# EAGLE schematic SeismicAccelerometerSystem (EAGLE 9.6.2)

## Sheet 1 of 3
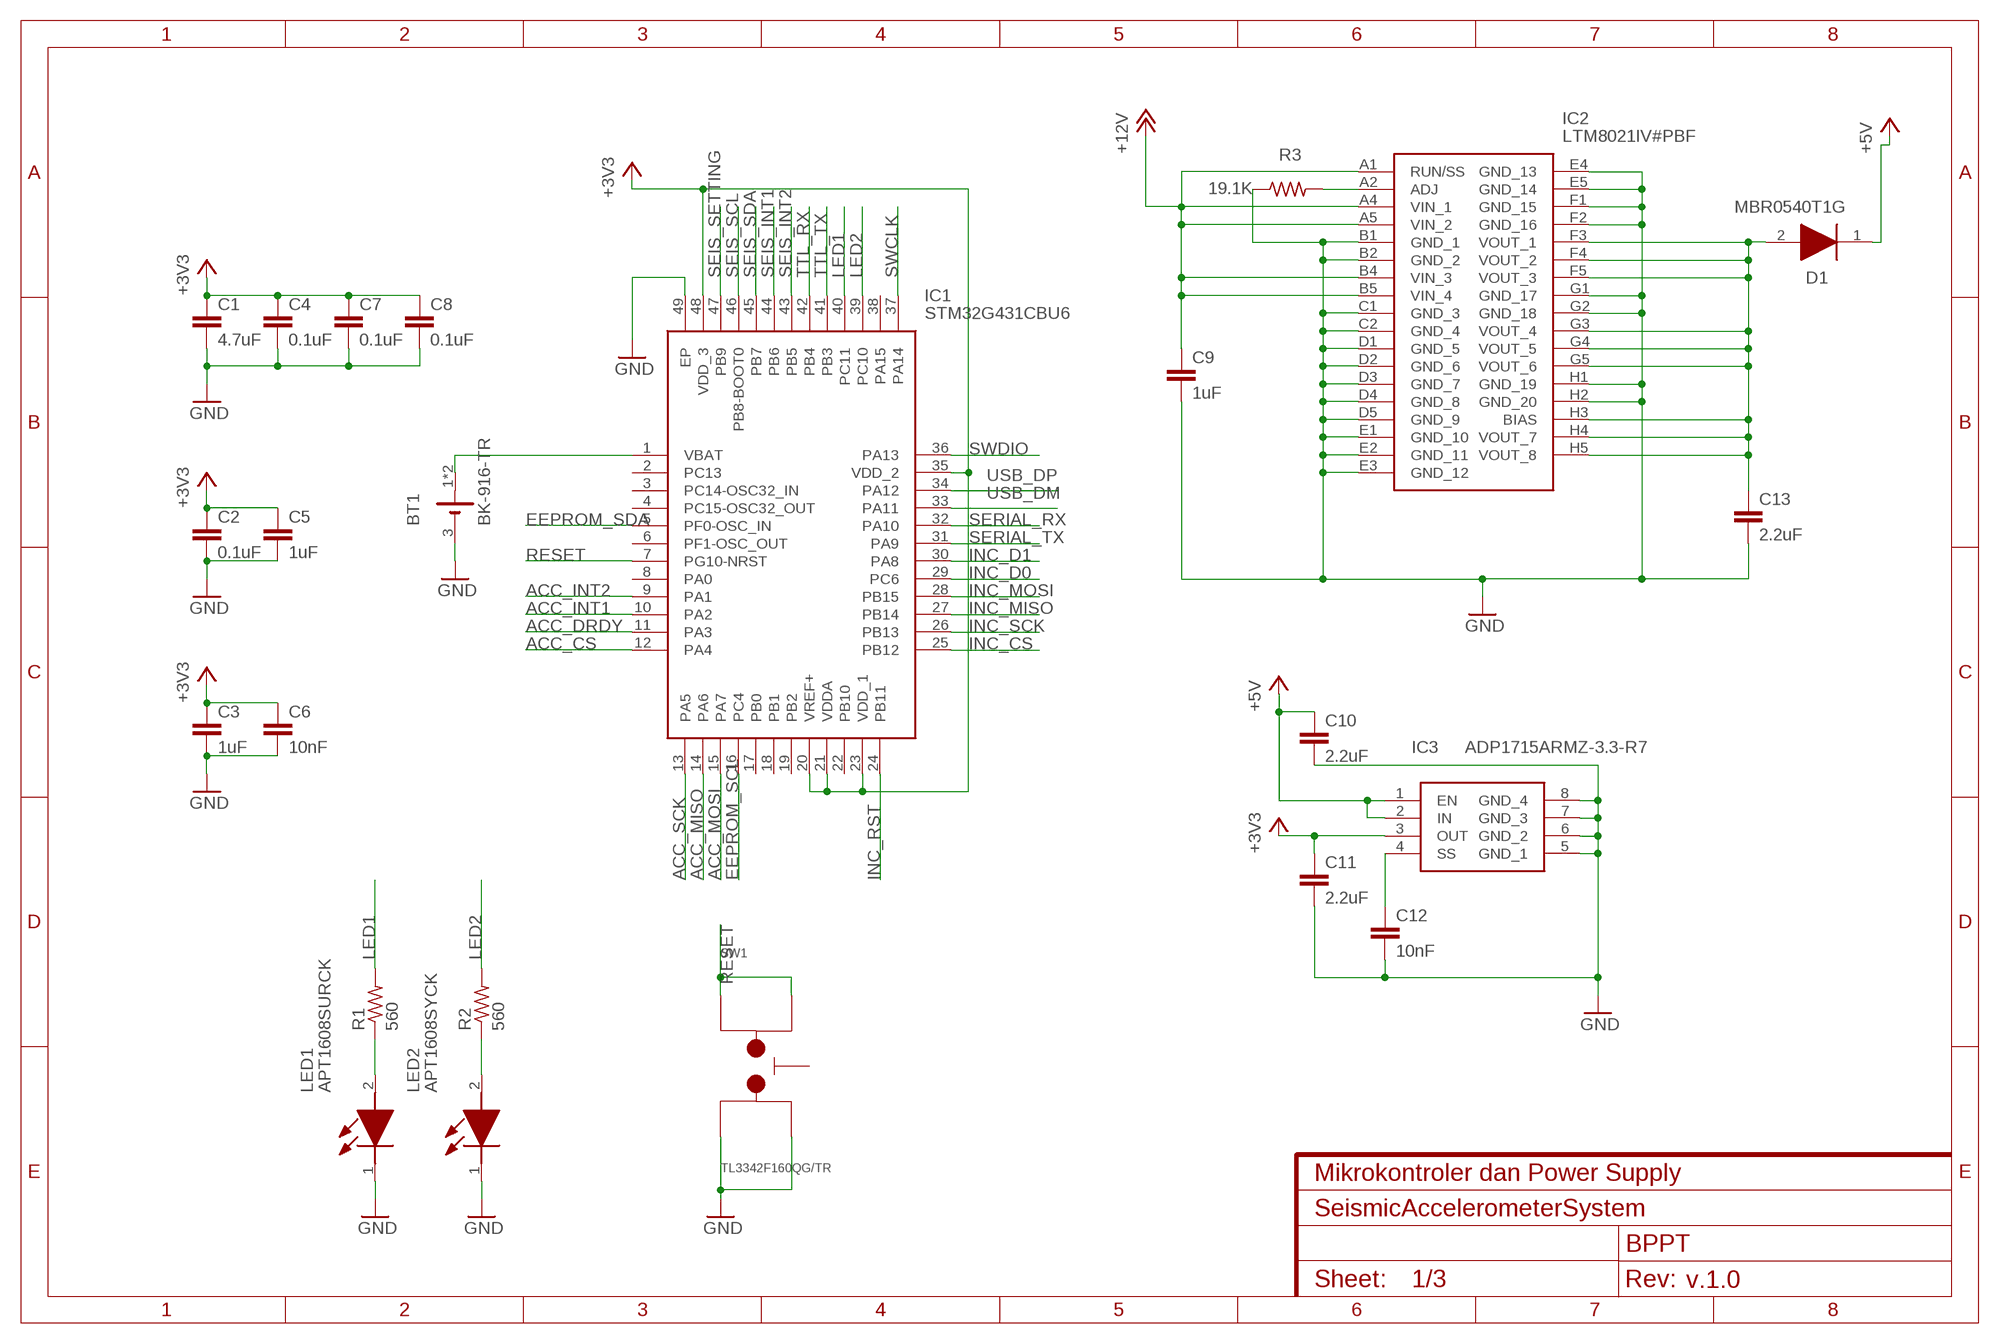
[diagram p0: schematic, sheet 1]
FRAME3 (FRAME-A4L): CNAME: Mikrokontroler dan Power Supply; CREVISION: v.1.0; DESIGNER: BPPT

### Parts
BT1  BK-916-TR  [BAT_BK-916-TR]
C1  4.7uF  C0603-KEMET  [CAPC1608X80N-0603-KEMET]
C2  0.1uF  C0402-KEMET  [CAPC1005X50N-0402-KEMET]
C3  1uF  C0402-KEMET  [CAPC1005X50N-0402-KEMET]
C4  0.1uF  C0402-KEMET  [CAPC1005X50N-0402-KEMET]
C5  1uF  C0402-KEMET  [CAPC1005X50N-0402-KEMET]
C6  10nF  C0402-KEMET  [CAPC1005X50N-0402-KEMET]
C7  0.1uF  C0402-KEMET  [CAPC1005X50N-0402-KEMET]
C8  0.1uF  C0402-KEMET  [CAPC1005X50N-0402-KEMET]
C9  1uF  C0805-KEMET  [CAPC2113X90N-0805-KEMET]
C10  2.2uF  C0603-KEMET  [CAPC1608X80N-0603-KEMET]
C11  2.2uF  C0603-KEMET  [CAPC1608X80N-0603-KEMET]
C12  10nF  C0402-KEMET  [CAPC1005X50N-0402-KEMET]
C13  2.2uF  C0805-KEMET  [CAPC2113X90N-0805-KEMET]
D1  MBR0540T1G  [SOD3716X135N]
IC1  STM32G431CBU6  [QFN50P700X700X65-49N]
IC2  LTM8021IV#PBF  [LTM8021IVPBF]
IC3  ADP1715ARMZ-3.3-R7  [SOP65P490X110-8N]
LED1  APT1608SURCK  [LEDC1608X85N]
LED2  APT1608SYCK  [LEDC1608X85N]
R1  560  R0402-TE  [RESC1005X30N]
R2  560  R0402-TE  [RESC1005X30N]
R3  19.1K  R0402-TE  [RESC1005X30N]
SW1  TL3342F160QG/TR  [TL3342F160QG/TR]

### Nets
+3V3: C1.1 C2.1 C3.1 C4.1 C5.1 C6.1 C7.1 C8.1 C11.1 IC1.20(VREF+) IC1.21(VDDA) IC1.23(VDD_1) IC1.35(VDD_2) IC1.48(VDD_3) IC3.3(OUT) ; also sheet 2,3
+5V: C10.1 D1.1(K) IC3.1(EN) IC3.2(IN) ; also sheet 3
+12V: C9.1 IC2.A1(RUN/SS) IC2.A4(VIN_1) IC2.A5(VIN_2) IC2.B4(VIN_3) IC2.B5(VIN_4) ; also sheet 3
ACC_CS: IC1.12(PA4) ; also sheet 2
ACC_DRDY: IC1.11(PA3) ; also sheet 2
ACC_INT1: IC1.10(PA2) ; also sheet 2
ACC_INT2: IC1.9(PA1) ; also sheet 2
ACC_MISO: IC1.14(PA6) ; also sheet 2
ACC_MOSI: IC1.15(PA7) ; also sheet 2
ACC_SCK: IC1.13(PA5) ; also sheet 2
EEPROM_SCL: IC1.16(PC4) ; also sheet 3
EEPROM_SDA: IC1.5(PF0-OSC_IN) ; also sheet 3
GND: BT1.3(-) C1.2 C2.2 C3.2 C4.2 C5.2 C6.2 C7.2 C8.2 C9.2 C10.2 C11.2 C12.2 C13.2 IC1.49(EP) IC2.B1(GND_1) IC2.B2(GND_2) IC2.C1(GND_3) IC2.C2(GND_4) IC2.D1(GND_5) IC2.D2(GND_6) IC2.D3(GND_7) IC2.D4(GND_8) IC2.D5(GND_9) IC2.E1(GND_10) IC2.E2(GND_11) IC2.E3(GND_12) IC2.E4(GND_13) IC2.E5(GND_14) IC2.F1(GND_15) IC2.F2(GND_16) IC2.G1(GND_17) IC2.G2(GND_18) IC2.H1(GND_19) IC2.H2(GND_20) IC3.5(GND_1) IC3.6(GND_2) IC3.7(GND_3) IC3.8(GND_4) LED1.1(K) LED2.1(K) R3.1 SW1.1 SW1.2 ; also sheet 2,3
INC_CS: IC1.25(PB12) ; also sheet 2
INC_D0: IC1.29(PC6) ; also sheet 2
INC_D1: IC1.30(PA8) ; also sheet 2
INC_MISO: IC1.27(PB14) ; also sheet 2
INC_MOSI: IC1.28(PB15) ; also sheet 2
INC_RST: IC1.24(PB11) ; also sheet 2
INC_SCK: IC1.26(PB13) ; also sheet 2
LED1: IC1.40(PC11) R1.2
LED2: IC1.39(PC10) R2.2
N$1: C13.1 D1.2(A) IC2.F3(VOUT_1) IC2.F4(VOUT_2) IC2.F5(VOUT_3) IC2.G3(VOUT_4) IC2.G4(VOUT_5) IC2.G5(VOUT_6) IC2.H3(BIAS) IC2.H4(VOUT_7) IC2.H5(VOUT_8)
N$2: BT1.1(+) BT1.2(+) IC1.1(VBAT)
N$50: IC2.A2(ADJ) R3.2
N$52: C12.1 IC3.4(SS)
N$104: LED1.2(A) R1.1
N$108: LED2.2(A) R2.1
RESET: IC1.7(PG10-NRST) SW1.3 SW1.4 ; also sheet 3
SEIS_INT1: IC1.44(PB6) ; also sheet 2
SEIS_INT2: IC1.43(PB5) ; also sheet 2
SEIS_SCL: IC1.46(PB8-BOOT0) ; also sheet 2
SEIS_SDA: IC1.45(PB7) ; also sheet 2
SEIS_SETTING: IC1.47(PB9) ; also sheet 2
SERIAL_RX: IC1.32(PA10) ; also sheet 3
SERIAL_TX: IC1.31(PA9) ; also sheet 3
SWCLK: IC1.37(PA14) ; also sheet 3
SWDIO: IC1.36(PA13) ; also sheet 3
TTL_RX: IC1.42(PB4) ; also sheet 3
TTL_TX: IC1.41(PB3) ; also sheet 3
USB_DM: IC1.33(PA11)
USB_DP: IC1.34(PA12)
Unconnected: IC1.2(PC13) IC1.3(PC14-OSC32_IN) IC1.4(PC15-OSC32_OUT) IC1.6(PF1-OSC_OUT) IC1.8(PA0) IC1.17(PB0) IC1.18(PB1) IC1.19(PB2) IC1.22(PB10) IC1.38(PA15)

## Sheet 2 of 3
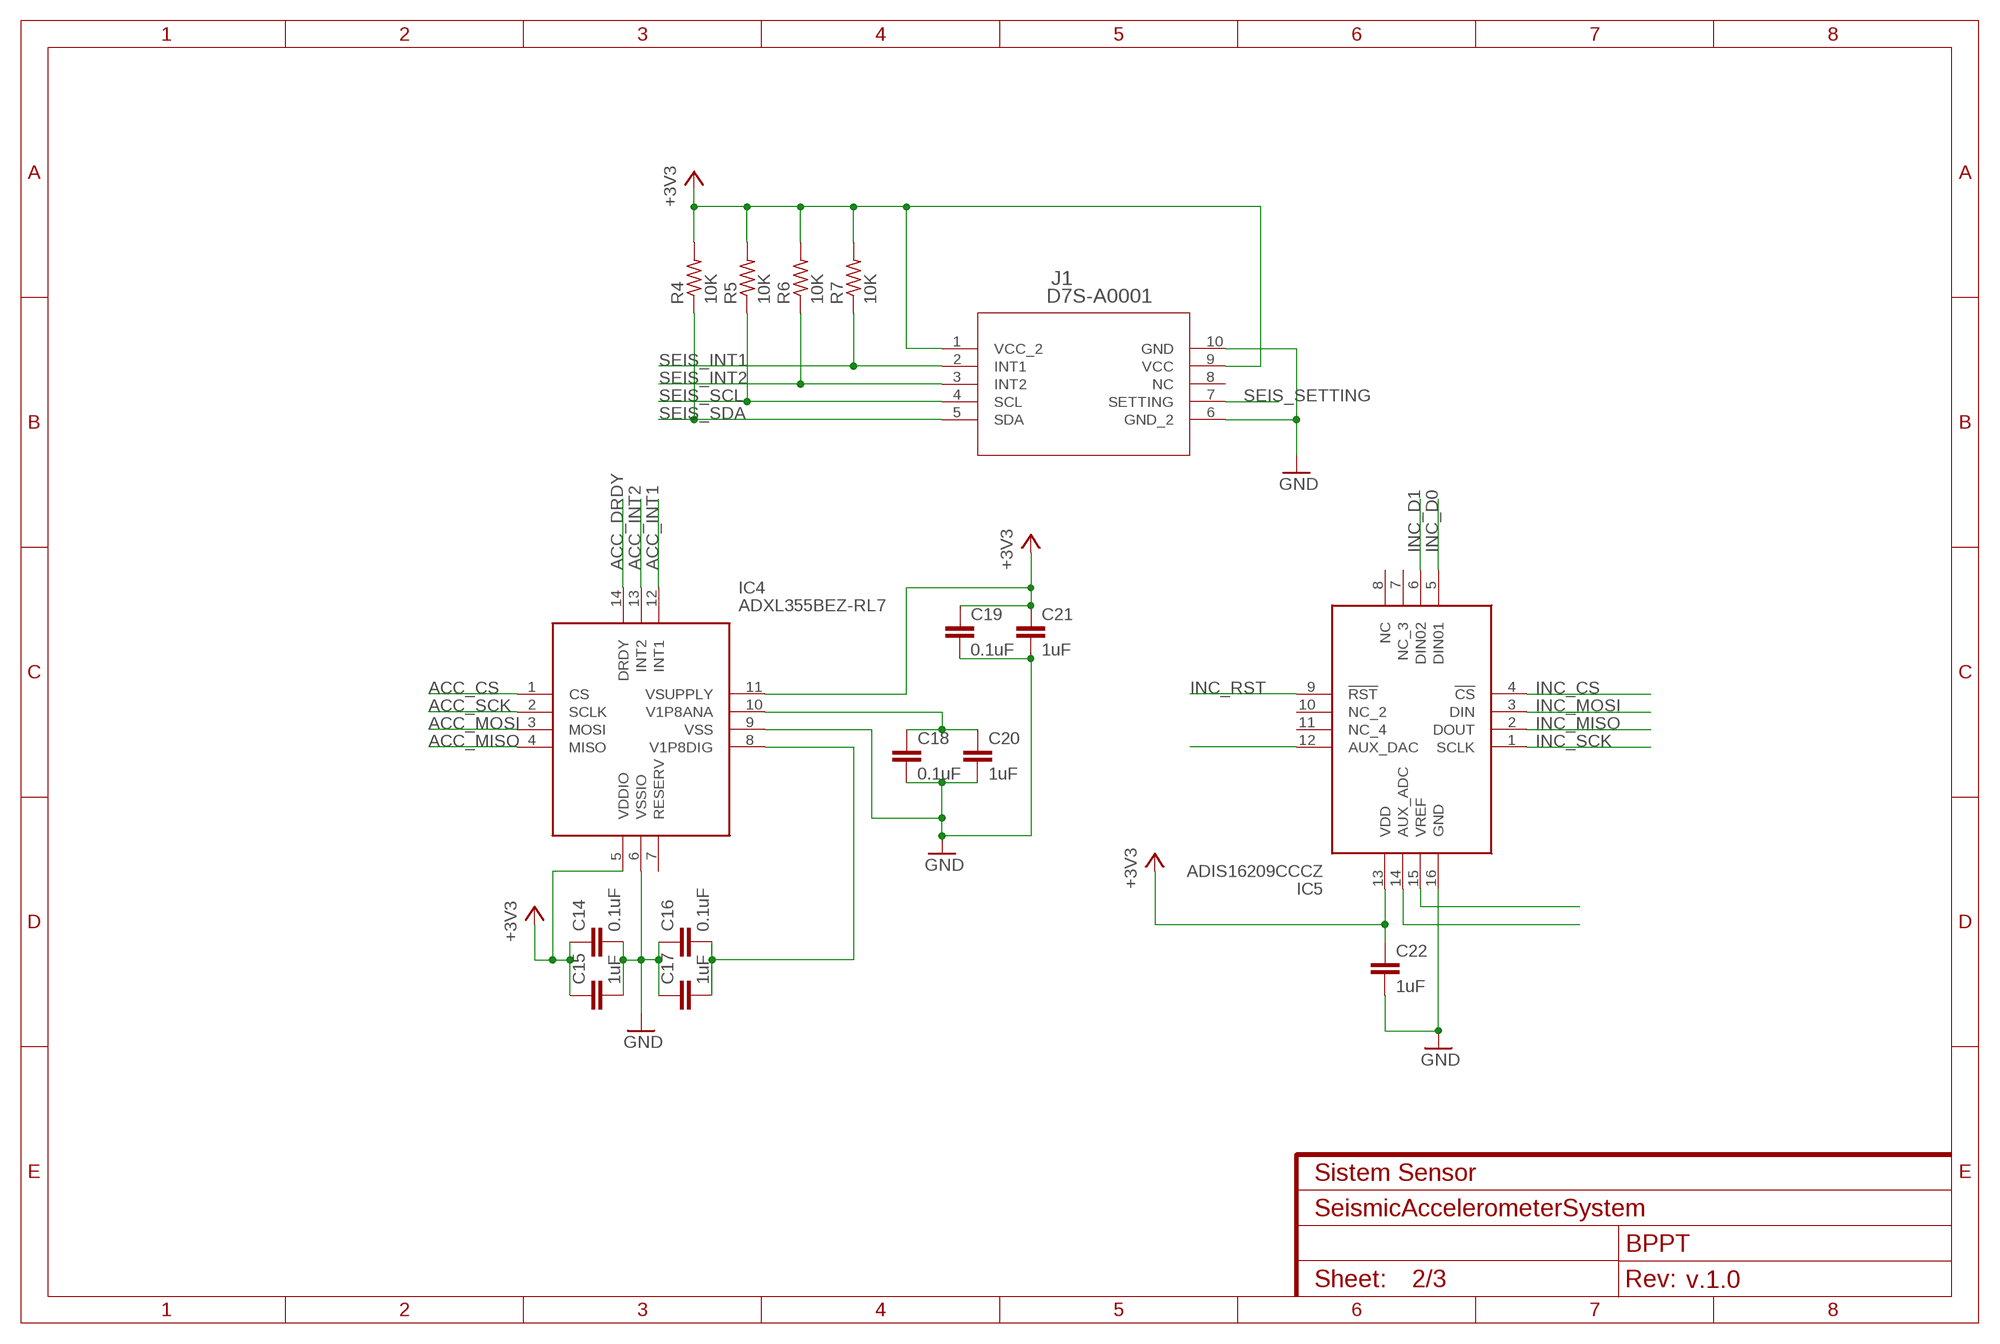
[diagram p1: schematic, sheet 2]
FRAME2 (FRAME-A4L): CNAME: Sistem Sensor; CREVISION: v.1.0; DESIGNER: BPPT

### Parts
C14  0.1uF  C0402-KEMET  [CAPC1005X50N-0402-KEMET]
C15  1uF  C0402-KEMET  [CAPC1005X50N-0402-KEMET]
C16  0.1uF  C0402-KEMET  [CAPC1005X50N-0402-KEMET]
C17  1uF  C0402-KEMET  [CAPC1005X50N-0402-KEMET]
C18  0.1uF  C0402-KEMET  [CAPC1005X50N-0402-KEMET]
C19  0.1uF  C0402-KEMET  [CAPC1005X50N-0402-KEMET]
C20  1uF  C0402-KEMET  [CAPC1005X50N-0402-KEMET]
C21  1uF  C0402-KEMET  [CAPC1005X50N-0402-KEMET]
C22  1uF  C0402-KEMET  [CAPC1005X50N-0402-KEMET]
IC4  ADXL355BEZ-RL7  [ADXL355BEZRL7]
IC5  ADIS16209CCCZ  [LGA16R180P4X4_933X933X390]
J1  D7S-A0001  [D7S-A0001_OMR]
R4  10K  R0402-TE  [RESC1005X30N]
R5  10K  R0402-TE  [RESC1005X30N]
R6  10K  R0402-TE  [RESC1005X30N]
R7  10K  R0402-TE  [RESC1005X30N]

### Nets
+3V3: C14.1 C15.1 C19.1 C21.1 C22.1 IC4.5(VDDIO) IC4.11(VSUPPLY) IC5.13(VDD) J1.1(VCC_2) J1.9(VCC) R4.2 R5.2 R6.2 R7.2 ; also sheet 1,3
ACC_CS: IC4.1(CS) ; also sheet 1
ACC_DRDY: IC4.14(DRDY) ; also sheet 1
ACC_INT1: IC4.12(INT1) ; also sheet 1
ACC_INT2: IC4.13(INT2) ; also sheet 1
ACC_MISO: IC4.4(MISO) ; also sheet 1
ACC_MOSI: IC4.3(MOSI) ; also sheet 1
ACC_SCK: IC4.2(SCLK) ; also sheet 1
GND: C14.2 C15.2 C16.1 C17.1 C18.2 C19.2 C20.2 C21.2 C22.2 IC4.6(VSSIO) IC4.9(VSS) IC5.16(GND) J1.6(GND_2) J1.10(GND) ; also sheet 1,3
INC_CS: IC5.4(!CS) ; also sheet 1
INC_D0: IC5.5(DIN01) ; also sheet 1
INC_D1: IC5.6(DIN02) ; also sheet 1
INC_MISO: IC5.2(DOUT) ; also sheet 1
INC_MOSI: IC5.3(DIN) ; also sheet 1
INC_RST: IC5.9(!RST) ; also sheet 1
INC_SCK: IC5.1(SCLK) ; also sheet 1
N$56: C16.2 C17.2 IC4.8(V1P8DIG)
N$57: C18.1 C20.1 IC4.10(V1P8ANA)
N$73: IC5.12(AUX_DAC)
N$77: IC5.15(VREF)
N$78: IC5.14(AUX_ADC)
SEIS_INT1: J1.2(INT1) R7.1 ; also sheet 1
SEIS_INT2: J1.3(INT2) R6.1 ; also sheet 1
SEIS_SCL: J1.4(SCL) R5.1 ; also sheet 1
SEIS_SDA: J1.5(SDA) R4.1 ; also sheet 1
SEIS_SETTING: J1.7(SETTING) ; also sheet 1
Unconnected: IC4.7(RESERV) IC5.7(NC_3) IC5.8(NC) IC5.10(NC_2) IC5.11(NC_4) J1.8(NC)

## Sheet 3 of 3
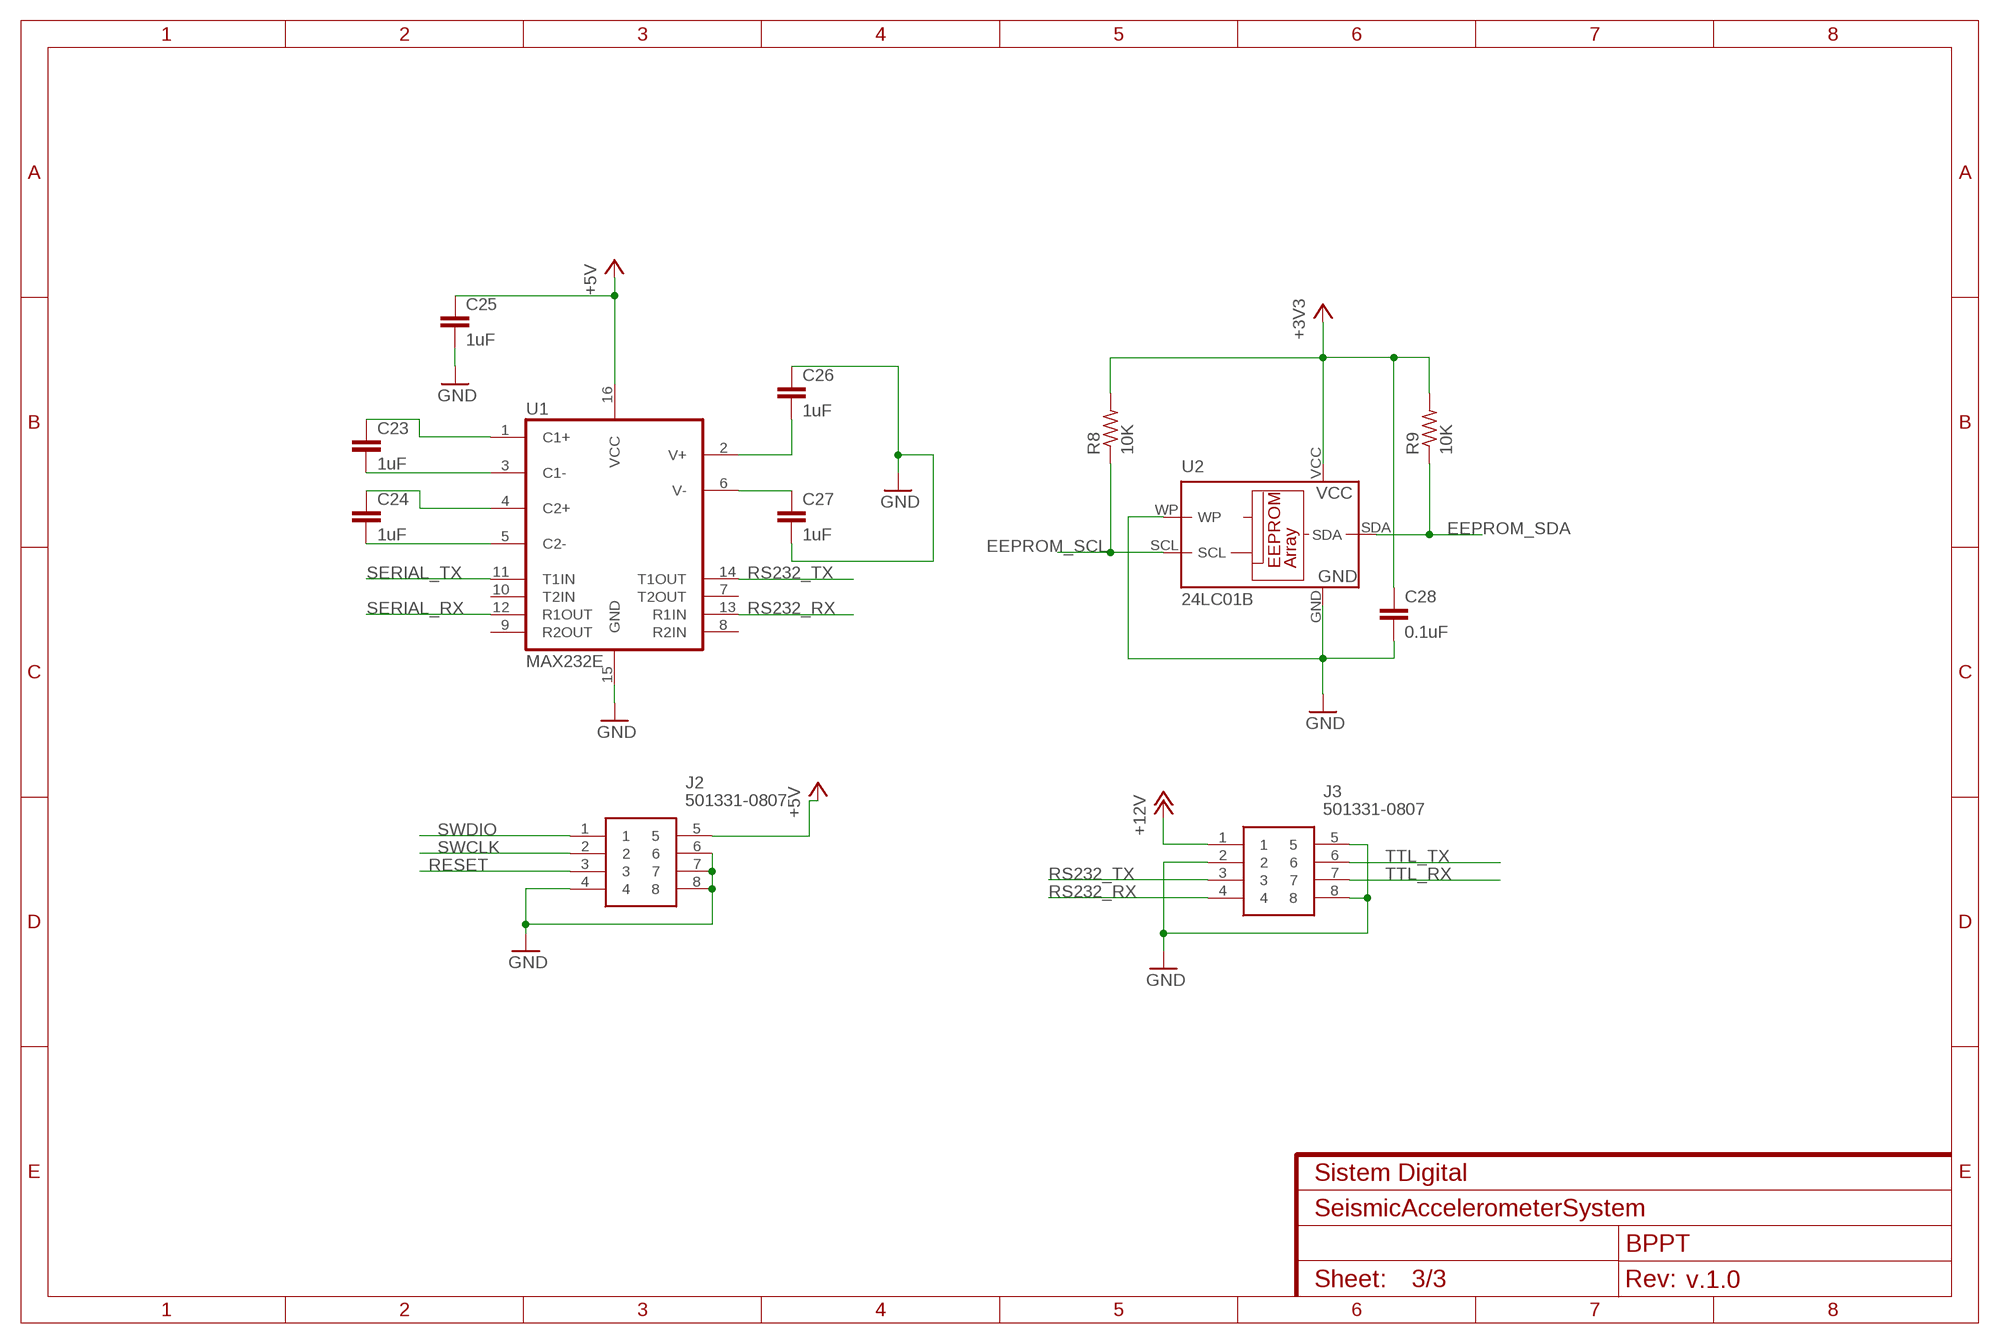
[diagram p2: schematic, sheet 3]
FRAME1 (FRAME-A4L): CNAME: Sistem Digital; CREVISION: v.1.0; DESIGNER: BPPT

### Parts
C23  1uF  C0603-KEMET  [CAPC1608X80N-0603-KEMET]
C24  1uF  C0603-KEMET  [CAPC1608X80N-0603-KEMET]
C25  1uF  C0603-KEMET  [CAPC1608X80N-0603-KEMET]
C26  1uF  C0603-KEMET  [CAPC1608X80N-0603-KEMET]
C27  1uF  C0603-KEMET  [CAPC1608X80N-0603-KEMET]
C28  0.1uF  C0402-KEMET  [CAPC1005X50N-0402-KEMET]
J2  501331-0807  [501331-0807]
J3  501331-0807  [501331-0807]
R8  10K  R0402-VISHAYDALE  [RESC1005X35N-0402-VISHAYDALE]
R9  10K  R0402-VISHAYDALE  [RESC1005X35N-0402-VISHAYDALE]
U1  MAX232E  [SOIC127P1030X265-16N]
U2  24LC01B  [SOT23-5L]

### Nets
+3V3: C28.1 R8.2 R9.2 U2.VCC ; also sheet 1,2
+5V: C25.1 J2.5 U1.16(VCC) ; also sheet 1
+12V: J3.1 ; also sheet 1
EEPROM_SCL: R8.1 U2.SCL ; also sheet 1
EEPROM_SDA: R9.1 U2.SDA ; also sheet 1
GND: C25.2 C26.1 C27.2 C28.2 J2.4 J2.6 J2.7 J2.8 J3.2 J3.5 J3.8 U1.15(GND) U2.GND U2.WP ; also sheet 1,2
N$95: C23.1 U1.1(C1+)
N$96: C23.2 U1.3(C1-)
N$97: C24.1 U1.4(C2+)
N$98: C24.2 U1.5(C2-)
N$99: C26.2 U1.2(V+)
N$100: C27.1 U1.6(V-)
RESET: J2.3 ; also sheet 1
RS232_RX: J3.4 U1.13(R1IN)
RS232_TX: J3.3 U1.14(T1OUT)
SERIAL_RX: U1.12(R1OUT) ; also sheet 1
SERIAL_TX: U1.11(T1IN) ; also sheet 1
SWCLK: J2.2 ; also sheet 1
SWDIO: J2.1 ; also sheet 1
TTL_RX: J3.7 ; also sheet 1
TTL_TX: J3.6 ; also sheet 1
Unconnected: U1.7(T2OUT) U1.8(R2IN) U1.9(R2OUT) U1.10(T2IN)

## Library data of the parts
BT1 = BK-916-TR:BK-916-TR: Cr1220, 1225 Battery Retainer w/; DESCRIPTION: BATTERY RETAINER COIN 12MM SMD; DIGIKEY-PURCHASE-URL: https://snapeda.com/shop?store=DigiKey&id=4872100; DIGIKEYLINK: https://www.digikey.com/en/products/detail/mpd-memory-protection-devices/BK-916-TR/6200238; MANUFACTURERNAME: MPD (Memory Protection Devices); MANUFACTURERPARTNUMBER: BK-916-TR; MF: MPD (Memory Protection Devices); MP: BK-916-TR; PACKAGE: None; TYPE: SMD
C1 = Resistor Capacitor Standard Eagle 3D:C0603-KEMET; DESCRIPTION: CAP CER 4.7UF 6.3V X5R 0603; DIGIKEYLINK: https://www.digikey.com/en/products/detail/kemet/C0603C475K9PACTU/754775; MANUFACTURERNAME: KEMET; MANUFACTURERPARTNUMBER: C0603C475K9PACTU; TYPE: SMD
C2 C4 C7 C8 C14 C16 C18 C19 = Resistor Capacitor Standard Eagle 3D:C0402-KEMET; DESCRIPTION: CAP CER 0.1UF 16V X7R 0402; DIGIKEYLINK: https://www.digikey.com/en/products/detail/kemet/C0402C104K4RACTU/789661; MANUFACTURERNAME: KEMET; MANUFACTURERPARTNUMBER: C0402C104K4RACTU; TYPE: SMD
C3 C5 = Resistor Capacitor Standard Eagle 3D:C0402-KEMET; DESCRIPTION: 1µF ±10% 6.3V Ceramic Capacitor X5R 0402 (1005 Metric); DIGIKEYLINK: https://www.digikey.com/en/products/detail/yageo/CC0402KRX5R5BB105/2833603; MANUFACTURERNAME: Yageo; MANUFACTURERPARTNUMBER: CC0402KRX5R5BB105; TYPE: SMD
C6 = Resistor Capacitor Standard Eagle 3D:C0402-KEMET; DESCRIPTION: CAP CER 10000PF 25V X7R 0402; DIGIKEYLINK: https://www.digikey.com/en/products/detail/kemet/C0402C103K3RACTU/416041; MANUFACTURERNAME: KEMET; MANUFACTURERPARTNUMBER: C0402C103K3RACTU; TYPE: SMD
C9 = Resistor Capacitor Standard Eagle 3D:C0805-KEMET; DESCRIPTION: CAP CER 1UF 50V X7R 0805; DIGIKEYLINK: https://www.digikey.com/product-detail/en/kemet/C0805C105K5RACTU/399-7409-1-ND/3317443; MANUFACTURERNAME: KEMET; MANUFACTURERPARTNUMBER: C0805C105K5RACTU; TYPE: SMD
C10 C11 = Resistor Capacitor Standard Eagle 3D:C0603-KEMET; DESCRIPTION: CAP CER 2.2UF 16V X5R 0603; DIGIKEYLINK: https://www.digikey.com/product-detail/en/tdk-corporation/C1608X5R1C225K080AB/445-5157-1-ND/2093772; MANUFACTURERNAME: TDK Corporation; MANUFACTURERPARTNUMBER: C1608X5R1C225K080AB; TYPE: SMD
C12 = Resistor Capacitor Standard Eagle 3D:C0402-KEMET; DESCRIPTION: CAP CER 10000PF 16V X7R 0402; DIGIKEYLINK: https://www.digikey.com/product-detail/en/yageo/CC0402KRX7R7BB103/311-1042-1-ND/302959; MANUFACTURERNAME: Yageo; MANUFACTURERPARTNUMBER: CC0402KRX7R7BB103; TYPE: SMD
C13 = Resistor Capacitor Standard Eagle 3D:C0805-KEMET; DESCRIPTION: CAP CER 2.2UF 10V X7R 0805; DIGIKEYLINK: https://www.digikey.com/product-detail/en/kemet/C0805C225K8RACTU/399-3522-1-ND/789662; MANUFACTURERNAME: KEMET; MANUFACTURERPARTNUMBER: C0805C225K8RACTU; TYPE: SMD
C15 C17 C20 C21 = Resistor Capacitor Standard Eagle 3D:C0402-KEMET; DESCRIPTION: CAP CER 1UF 6.3V X5R 0402; DIGIKEYLINK: https://www.digikey.com/en/products/detail/yageo/CC0402KRX5R5BB105/2833603; MANUFACTURERNAME: Yageo; MANUFACTURERPARTNUMBER: CC0402KRX5R5BB105; TYPE: SMD
C22 = Resistor Capacitor Standard Eagle 3D:C0402-KEMET; DESCRIPTION: CAP CER 0.1UF 16V X7R 0402; DIGIKEYLINK: https://www.digikey.com/product-detail/en/tdk-corporation/CGA2B1X7R1C104K050BC/445-5613-1-ND/2443653; MANUFACTURERNAME: TDK Corporation; MANUFACTURERPARTNUMBER: CGA2B1X7R1C104K050BC; TYPE: SMD
C23-C27 = Resistor Capacitor Standard Eagle 3D:C0603-KEMET; DESCRIPTION: CAP CER 1UF 16V X7R 0603; DIGIKEYLINK: https://www.digikey.com/en/products/detail/tdk-corporation/CGA3E1X7R1C105K080AC/3949775; MANUFACTURERNAME: TDK Corporation; MANUFACTURERPARTNUMBER: CGA3E1X7R1C105K080AC; TYPE: SMD
C28 = Resistor Capacitor Standard Eagle 3D:C0402-KEMET; DESCRIPTION: CAP CER 0.1UF 16V Y5V 0402; DIGIKEYLINK: https://www.digikey.com/en/products/detail/kemet/C0402C104Z4VAC7867/411045; MANUFACTURERNAME: KEMET; MANUFACTURERPARTNUMBER: C0402C104Z4VAC7867; TYPE: SMD
D1 = SamacSys_Parts:MBR0540T1G: 0.5A 40V Schottky Rectifier, MBR0540T1G ON Semiconductor MBR0540T1G Schottky Diode, 0.5A, 40V, 2-Pin SOD-123 Source: Datasheet <http://www.onsemi.com/pub/Collateral/MBR0540T1-D.PDF>; ARROW_PART_NUMBER: MBR0540T1G; ARROW_PRICE-STOCK: https://www.arrow.com/en/products/mbr0540t1g/on-semiconductor; DESCRIPTION: 0.5A 40V Schottky Rectifier, MBR0540T1G ON Semiconductor MBR0540T1G Schottky Diode, 0.5A, 40V, 2-Pin SOD-123; DIGIKEYLINK: https://www.digikey.com/en/products/detail/on-semiconductor/MBR0540T1G/918576?s=N4IgTCBcDaILICEBKAGArAFhQFQIwHEQBdAXyA; HEIGHT: 1.35mm; MANUFACTURERNAME: ON Semiconductor; MANUFACTURERPARTNUMBER: MBR0540T1G; MANUFACTURER_NAME: ON Semiconductor; MANUFACTURER_PART_NUMBER: MBR0540T1G; MOUSER_PART_NUMBER: 863-MBR0540T1G; MOUSER_PRICE-STOCK: https://www.mouser.co.uk/ProductDetail/ON-Semiconductor/MBR0540T1G/?qs=3JMERSakebqeY0cO5%252BUPCQ%3D%3D; TYPE: SMD
IC1 = SamacSys_Parts:STM32G431CBU6: STMICROELECTRONICS - STM32G431CBU6 - MCU, 32BIT, 170MHZ, UFQFPN-48 Source: Datasheet <https://www.st.com/resource/en/datasheet/stm32g431cb.pdf>; ARROW_PART_NUMBER: STM32G431CBU6; ARROW_PRICE-STOCK: https://www.arrow.com/en/products/stm32g431cbu6/stmicroelectronics; DESCRIPTION: IC MCU 32BIT 128KB FLSH 48UFQFPN; DIGIKEYLINK: https://www.digikey.com/en/products/detail/stmicroelectronics/STM32G431CBU6/10231569; HEIGHT: 0.65mm; MANUFACTURERNAME: STMicroelectronics; MANUFACTURERPARTNUMBER: STM32G431CBU6; MANUFACTURER_NAME: STMicroelectronics; MANUFACTURER_PART_NUMBER: STM32G431CBU6; MOUSER_PART_NUMBER: 511-STM32G431CBU6; MOUSER_PRICE-STOCK: https://www.mouser.co.uk/ProductDetail/STMicroelectronics/STM32G431CBU6/?qs=T3oQrply3y%252B0hTuSHQ7oqA%3D%3D; TYPE: SMD
IC2 = SamacSys_Parts:LTM8021IV#PBF: Switching Voltage Regulators Source: Datasheet <https://www.arrow.com/en/products/ltm8021ivpbf/analog-devices>; ARROW_PART_NUMBER: LTM8021IV#PBF; ARROW_PRICE-STOCK: https://www.arrow.com/en/products/ltm8021ivpbf/analog-devices; DESCRIPTION: DC DC CONVERTER 0.8-5V 500MA; DIGIKEYLINK: https://www.digikey.com/product-detail/en/analog-devices-inc/LTM8021IV-PBF/LTM8021IV-PBF-ND/1859094; HEIGHT: 2.92mm; MANUFACTURERNAME: Analog Devices Inc.; MANUFACTURERPARTNUMBER: LTM8021IV#PBF; MANUFACTURER_NAME: Analog Devices; MANUFACTURER_PART_NUMBER: LTM8021IV#PBF; TYPE: SMD
IC3 = SamacSys_Parts:ADP1715ARMZ-3.3-R7: Analog Devices ADP1715ARMZ-3.3-R7, LDO Regulator, 500mA, 3.3 V, +/-3%, 2.5 5.5 Vin 8-Pin, MSOP Source: Datasheet <https://www.analog.com/media/en/technical-documentation/data-sheets/ADP1715_1716.pdf>; ARROW_PART_NUMBER: ADP1715ARMZ-3.3-R7; ARROW_PRICE-STOCK: https://www.arrow.com/en/products/adp1715armz-3.3-r7/analog-devices; DESCRIPTION: IC REG LINEAR 3.3V 500MA 8MSOP; DIGIKEYLINK: https://www.digikey.com/product-detail/en/analog-devices-inc/ADP1715ARMZ-3.3-R7/ADP1715ARMZ-3.3-R7CT-ND/1630787; HEIGHT: 1.1mm; MANUFACTURERNAME: Analog Devices Inc.; MANUFACTURERPARTNUMBER: ADP1715ARMZ-3.3-R7; MANUFACTURER_NAME: Analog Devices; MANUFACTURER_PART_NUMBER: ADP1715ARMZ-3.3-R7; MOUSER_PART_NUMBER: 584-ADP1715ARMZ3.3R7; MOUSER_PRICE-STOCK: https://www.mouser.co.uk/ProductDetail/Analog-Devices/ADP1715ARMZ-33-R7?qs=WIvQP4zGangwvEjYWS0N2Q%3D%3D; TYPE: SMD
IC4 = SamacSys_Parts:ADXL355BEZ-RL7: Accelerometer Triple +/-2.048g/+/-4.096g/+/-8.192g 3.3V 14-Pin CLLCC T/R Source: Datasheet <https://datasheet.datasheetarchive.com/originals/dk/DKDS-11/217700.pdf>; ARROW_PART_NUMBER: ADXL355BEZ-RL7; ARROW_PRICE-STOCK: https://www.arrow.com/en/products/adxl355bez-rl7/analog-devices; DESCRIPTION: Accelerometer X, Y, Z Axis ±2g, 4g, 8g 1.5kHz 14-CLCC (6x6); DIGIKEYLINK: https://www.mouser.co.id/ProductDetail/Analog-Devices/ADXL355BEZ-RL7/?qs=vcbl%252BK4rRleGsXj6gXOU1w==; HEIGHT: 2.2mm; MANUFACTURERNAME: Analog Devices Inc.; MANUFACTURERPARTNUMBER: ADXL355BEZ-RL7; MANUFACTURER_NAME: Analog Devices; MANUFACTURER_PART_NUMBER: ADXL355BEZ-RL7; MOUSER_PART_NUMBER: 584-ADXL355BEZ-RL7; MOUSER_PRICE-STOCK: https://www.mouser.co.uk/ProductDetail/Analog-Devices/ADXL355BEZ-RL7/?qs=vcbl%252BK4rRleGsXj6gXOU1w%3D%3D; TYPE: SMD
IC5 = SamacSys_Parts:ADIS16209CCCZ: IC, 2 AXIS ACCELEROMETER, 1.7G Source: Datasheet <http://componentsearchengine.com/Datasheets/1/ADIS16209CCCZ.pdf>; ARROW_PART_NUMBER: ADIS16209CCCZ; ARROW_PRICE-STOCK: https://www.arrow.com/en/products/adis16209cccz/analog-devices; DESCRIPTION: IMU ACCEL/INCLINE SPI 16LGA; DIGIKEYLINK: https://www.digikey.com/products/en/sensors-transducers/motion-sensors-inclinometers/533?k=ADIS16209; HEIGHT: mm; MANUFACTURERNAME: Analog Devices Inc; MANUFACTURERPARTNUMBER: ADIS16209CCCZ; MANUFACTURER_NAME: Analog Devices; MANUFACTURER_PART_NUMBER: ADIS16209CCCZ; MOUSER_PART_NUMBER: 584-ADIS16209CCCZ; MOUSER_PRICE-STOCK: https://www.mouser.co.uk/ProductDetail/Analog-Devices/ADIS16209CCCZ?qs=BpaRKvA4VqF4vbzuwcHdgA%3D%3D; TYPE: SMD
J1 = D7S-Omron-Seismometer:D7S-A0001; BUILT_BY: EMA_Justin; COPYRIGHT: Copyright (C) 2018 Accelerated Designs. All rights reserved; DESCRIPTION: SENSOR SEISMIC 3 AXIS EARTHQUAKE; DIGIKEYLINK: https://www.digikey.com/product-detail/en/omron-electronics-inc-emc-div/D7S-A0001/Z5835CT-ND/6133945; MANUFACTURERNAME: Omron Electronics Inc-EMC Div; MANUFACTURERPARTNUMBER: D7S-A0001; MANUFACTURER_PART_NUMBER: D7S-A0001; SOURCELIBRARY: Omron_2019-12-10; TYPE: SMD; VENDOR: Omron
J2 J3 = SamacSys_Parts:501331-0807: MOLEX - 501331-0807 - HEADER, 1.0MM, PICO-CLASP, 8WAY Source: Datasheet <http://www.farnell.com/cad/1984609.pdf>; ARROW_PART_NUMBER: 501331-0807; ARROW_PRICE-STOCK: https://www.arrow.com/en/products/5013310807/molex; DESCRIPTION: CONN HEADER SMD 8POS 1MM; DIGIKEYLINK: https://www.digikey.com/en/products/detail/molex/501331-0807/1531535; HEIGHT: mm; MANUFACTURERNAME: Molex; MANUFACTURERPARTNUMBER: 5013310807; MANUFACTURER_NAME: Molex; MANUFACTURER_PART_NUMBER: 501331-0807; MOUSER_PART_NUMBER: 538-501331-0807; MOUSER_PRICE-STOCK: https://www.mouser.co.uk/ProductDetail/Molex/501331-0807?qs=uEWtSLL707WCWoLr2aeFsQ%3D%3D; TYPE: SMD
LED1 = SamacSys_Parts:APT1608SURCK: LED Uni-Color Red 650nm 2-Pin SMD T/R Source: Datasheet <http://www.us.kingbright.com/images/catalog/SPEC/APT1608SURCK.pdf>; ARROW_PART_NUMBER: APT1608SURCK; ARROW_PRICE-STOCK: https://www.arrow.com/en/products/apt1608surck/kingbright; DESCRIPTION: LED Uni-Color Red 650nm 2-Pin SMD T/R; DIGIKEYLINK: https://www.digikey.com/en/products/detail/kingbright/APT1608SURCK/1747522; HEIGHT: 0.85mm; MANUFACTURERNAME: Kingbright; MANUFACTURERPARTNUMBER: APT1608SURCK; MANUFACTURER_NAME: Kingbright; MANUFACTURER_PART_NUMBER: APT1608SURCK; MOUSER_PART_NUMBER: 604-APT1608SURCK; MOUSER_PRICE-STOCK: https://www.mouser.co.uk/ProductDetail/Kingbright/APT1608SURCK?qs=SO8VdE%2FgosEMhHbp2z1B7Q%3D%3D; TYPE: SMD
LED2 = SamacSys_Parts:APT1608SYCK: Standard LEDs - SMD YELLOW WATER CLEAR Source: Datasheet <http://docs-emea.rs-online.com/webdocs/142e/0900766b8142eada.pdf>; ARROW_PART_NUMBER: APT1608SYCK; ARROW_PRICE-STOCK: https://www.arrow.com/en/products/apt1608syck/kingbright; DESCRIPTION: Standard LEDs - SMD YELLOW WATER CLEAR; DIGIKEYLINK: https://www.digikey.com/en/products/detail/kingbright/APT1608SYCK/1747523; HEIGHT: 0.85mm; MANUFACTURERNAME: Kingbright; MANUFACTURERPARTNUMBER: APT1608SYCK; MANUFACTURER_NAME: Kingbright; MANUFACTURER_PART_NUMBER: APT1608SYCK; MOUSER_PART_NUMBER: 604-APT1608SYCK; MOUSER_PRICE-STOCK: https://www.mouser.co.uk/ProductDetail/Kingbright/APT1608SYCK?qs=JpELLRhtMc0wiA2na%2FwR8A%3D%3D; TYPE: SMD
R1 R2 = Resistor Capacitor Standard Eagle 3D:R0402-TE; DESCRIPTION: RES SMD 560 OHM 1% 1/5W 0402; DIGIKEYLINK: https://www.digikey.com/en/products/detail/vishay-dale/RCS0402560RFKED/5867669; MANUFACTURERNAME: Vishay Dale; MANUFACTURERPARTNUMBER: RCS0402560RFKED; TYPE: SMD
R3 = Resistor Capacitor Standard Eagle 3D:R0402-TE; DESCRIPTION: RES SMD 19.1K OHM 1% 1/10W 0402; DIGIKEYLINK: https://www.digikey.com/en/products/detail/panasonic-electronic-components/ERJ-2RKF1912X/192187; MANUFACTURERNAME: Panasonic Electronic Components; MANUFACTURERPARTNUMBER: ERJ-2RKF1912X; TYPE: SMD
R4-R7 = Resistor Capacitor Standard Eagle 3D:R0402-TE; DESCRIPTION: RES SMD 10K OHM 1% 1/16W 0402; DIGIKEYLINK: https://www.digikey.com/product-detail/en/yageo/RC0402FR-0710KL/311-10.0KLRCT-ND/729470; MANUFACTURERNAME: Yageo; MANUFACTURERPARTNUMBER: RC0402FR-0710KL; TYPE: SMD
R8 R9 = Resistor Capacitor Standard Eagle 3D:R0402-VISHAYDALE; DESCRIPTION: RES SMD 10K OHM 1% 1/16W 0402; DIGIKEYLINK: https://www.digikey.com/en/products/detail/yageo/RC0402FR-0710KL/726523; MANUFACTURERNAME: Yageo; MANUFACTURERPARTNUMBER: RC0402FR-0710KL; TYPE: SMD
SW1 = Switch:TL3342F160QG/TR: SWITCH TACTILE SPST-NO 0.05A 12V Manufacturer's datasheet <http://spec_sheets.e-switch.com/specs/P010632.pdf>; CREATED_BY: PCBLayout.com; DESCRIPTION: SWITCH TACTILE SPST-NO 0.05A 12V; DIGIKEYLINK: https://www.digikey.com/en/products/detail/e-switch/TL3342F160QG-TR/379003?s=N4IgTCBcDaICoBkDMSAsYBiBGAbABgEUBxAejgCUQBdAXyA; DIGI_KEY_PART_NUMBER: EG2531CT-ND; MANUFACTURER: E-Switch; MANUFACTURERNAME: E-Switch; MANUFACTURERPARTNUMBER: TL3342F160QG/TR; MPN: TL3342F160QG/TR; PACKAGE: SPST_NO; TYPE: SMD
U1 = MAX232E:MAX232E; DESCRIPTION: IC TRANSCEIVER FULL 2/2 16SOIC; DIGIKEYLINK: https://www.digikey.com/en/products/detail/texas-instruments/MAX232ECDW/1511009; MANUFACTURERNAME: Texas Instruments; MANUFACTURERPARTNUMBER: MAX232ECDW; TYPE: SMD
U2 = CostumHafiz:24LC01B; DESCRIPTION: IC EEPROM 1K I2C 400KHZ SOT23-5; DIGIKEYLINK: https://www.digikey.com/en/products/detail/microchip-technology/24LC01BT-I-OT/318651; MANUFACTURERNAME: Microchip Technology; MANUFACTURERPARTNUMBER: 24LC01BT-I/OT; TYPE: SMD